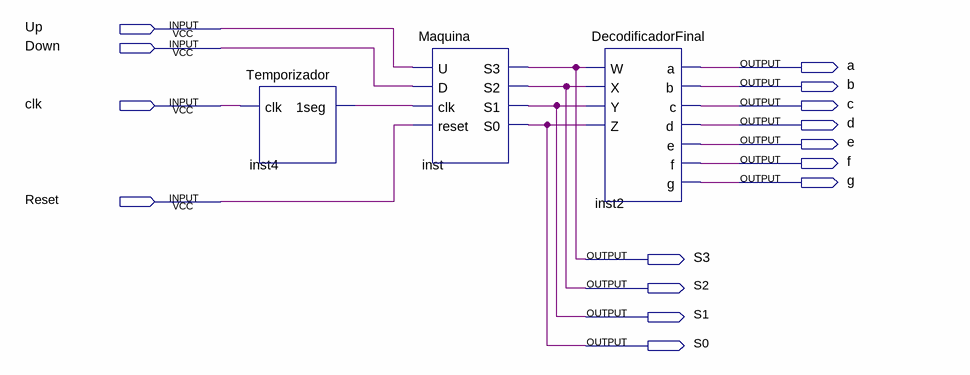
[diagram p0: schematic sheet]
// Quartus schematic MealyMachine.bdf as structural Verilog: 3 symbols, 15 pins
module MealyMachine (
  input  Up,
  input  Down,
  input  clk,
  input  Reset,
  output a,
  output b,
  output c,
  output d,
  output e,
  output f,
  output g,
  output S3,
  output S2,
  output S1,
  output S0
);

  wire inst4_1seg;

  Temporizador inst4 (.clk(clk), .\1seg (inst4_1seg));
  Maquina inst (.U(Up), .D(Down), .clk(inst4_1seg), .reset(Reset), .S3(S3), .S2(S2), .S1(S1), .S0(S0));
  DecodificadorFinal inst2 (.W(S3), .X(S2), .Y(S1), .Z(S0), .a(a), .b(b), .c(c), .d(d), .e(e), .f(f), .g(g));
endmodule
